# Altium project PCB_Project1.PrjPCB
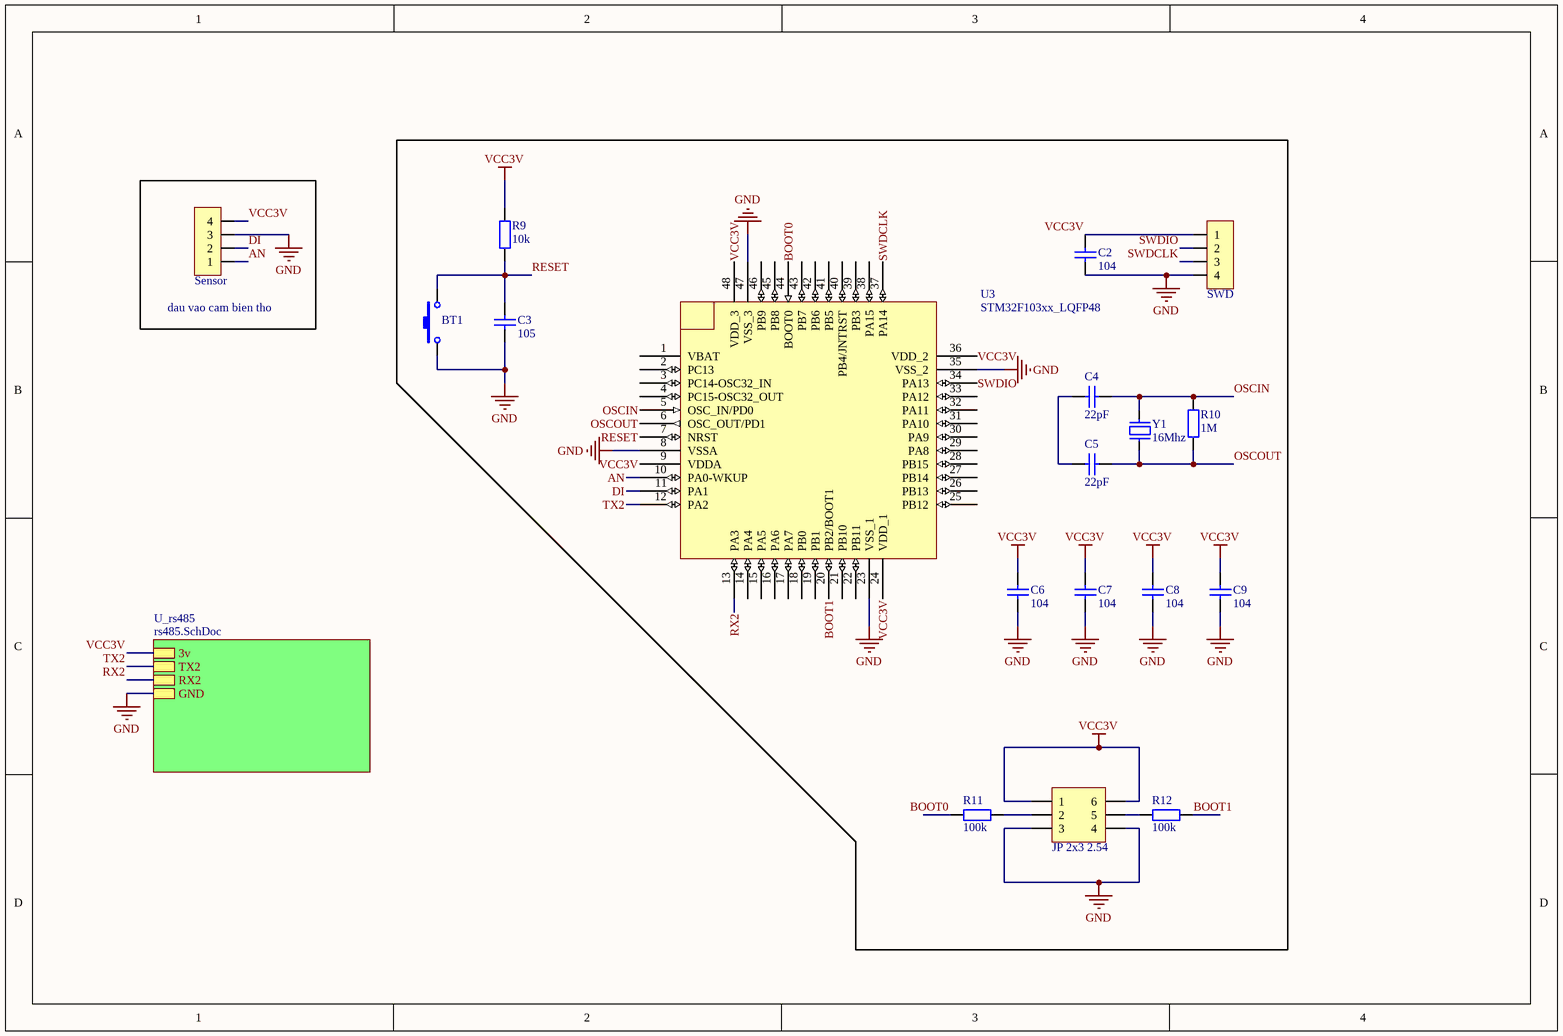
[diagram p0: Sheet1.SchDoc]
2 sheets, 38 parts. Net scope: hierarchical (ports join the sheet entries above them; power ports are global).
Board file: PCB1.PcbDoc
Sheets:
  Sheet1.SchDoc
    U_rs485 = rs485.SchDoc

## Sheet Sheet1.SchDoc
size A4

### Parts
BT1  Nut Nhan 2 Chan SMD 3x6x2.5  [Nut Nhan 2 Chan SMD 3x6x2.5]  (value not drawn)
C2  104  [tu 0603]
C3  105  [tu 0603]
C4  22pF  [tu 0603]
C5  22pF  [tu 0603]
C6  104  [tu 0603]
C7  104  [tu 0603]
C8  104  [tu 0603]
C9  104  [tu 0603]
JP1  Sensor  [JP 1x4 CC]
JP2  SWD  [JP 1x4 DT]
JP3  JP 2x3 2.54  [JP 2x3 DT]
R9  10k  [tro smd 0603]
R10  1M  [tro smd 0603]
R11  100k  [tro smd 0603]
R12  100k  [tro smd 0603]
U3  STM32F103xx_LQFP48  [STM32_LQPF48]
Y1  16Mhz  [Thach Anh 2 chan cam]

### Blocks framed on the sheet
dau vao cam bien tho: JP1

### Sub-sheets
U_rs485 = rs485.SchDoc: 3v, TX2, RX2, GND

### Nets
GND: BT1.1 C2.2 C3.2 C6.2 C7.2 C8.2 C9.2 JP1.3 JP2.4 JP3.3 JP3.4 U3.8(VSSA) U3.23(VSS_1) U3.35(VSS_2) U3.47(VSS_3) ; sheet U_rs485/GND
VCC3V: C2.1 C6.1 C7.1 C8.1 C9.1 JP1.4 JP2.1 JP3.1 JP3.6 R9.2 U3.9(VDDA) U3.24(VDD_1) U3.36(VDD_2) U3.48(VDD_3) ; sheet U_rs485/3v
AN: JP1.1 U3.10(PA0-WKUP)
BOOT0: R11.1 U3.44(BOOT0)
BOOT1: R12.2 U3.20(PB2/BOOT1)
DI: JP1.2 U3.11(PA1)
OSCIN: C4.1 R10.2 U3.5(OSC_IN/PD0) Y1.2
OSCOUT: C5.1 R10.1 U3.6(OSC_OUT/PD1) Y1.1
RESET: BT1.2 C3.1 R9.1 U3.7(NRST)
RX2: U3.13(PA3) ; sheet U_rs485/RX2
SWDCLK: JP2.3 U3.37(PA14)
SWDIO: JP2.2 U3.34(PA13)
TX2: U3.12(PA2) ; sheet U_rs485/TX2
NetC4_2: C4.2 C5.2
NetJP3_2: JP3.2 R11.2
NetJP3_5: JP3.5 R12.1

Not connected (* = marked no-connect by the designer): U3 1(VBAT) 2(PC13) 3(PC14-OSC32_IN) 4(PC15-OSC32_OUT) 14(PA4) 15(PA5) 16(PA6) 17(PA7) 18(PB0) 19(PB1) 21(PB10) 22(PB11) 25(PB12) 26(PB13) 27(PB14) 28(PB15) 29(PA8) 30(PA9) 31(PA10) 32(PA11) 33(PA12) 38(PA15) 39(PB3) 40(PB4/JNTRST) 41(PB5) 42(PB6) 43(PB7) 45(PB8) 46(PB9)

### Library data of the parts
BT1 = Nut Nhan 2 Chan SMD 3x6x2.5: Ma_Hang: MH001036; Ten: Nút Nhấn 2 Chân 3x6x2.5MM SMD
C2 C6-C9 = Tu 0603 104 50V 10%: Dán; Don_Vi: Con; So_Chan: 2; Ten_Linh_Kien: Tụ 0603 104-100nF 10% 50V; Ma_Hang: MH004568; Chung_Loai: Dán; Kieu_Chan: *
C3 = Tu 0603 105 16V 20%: Dán; Don_Vi: Con; So_Chan: 2; Ten_Linh_Kien: Tụ 0603 105-1uF 20% 16V; Ma_Hang: MH004574; Chung_Loai: Dán; Kieu_Chan: *
C4 C5 = Tu 0603 22pF 50V 10%: Dán; Don_Vi: Con; So_Chan: 2; Ten_Linh_Kien: Tụ 0603 22pF 50V 10%; Ma_Hang: MH004570; Chung_Loai: Dán; Kieu_Chan: *
JP1 = JP 1x4 2.54 Cai Cong: Cắm; Ten_Linh_Kien: Jump Đơn Cái 2.54MM 1x40P Cong; Don_Vi: Con; Ma_Hang: MH001265; Ghi_Chu: *; Kieu_Chan: *; Chung_Loai: Cắm
JP2 = JP 1x4 2.54 Duc Thang: Cắm; Ten_Linh_Kien: Jump Đơn Đực 2.54MM 1x40P Thẳng 11MM; Don_Vi: Con; Ma_Hang: MH000903; Ghi_Chu: *; Kieu_Chan: *; Chung_Loai: Cắm
JP3 = JP 2x3 2.54 Duc Thang: Cắm; Ten_Linh_Kien: Jump Đôi Đực 2.54MM 2x40P Thẳng 11MM; Don_Vi: Con; Ma_Hang: MH002686; Ghi_Chu: *; Kieu_Chan: *; Chung_Loai: Cắm
R9 = Tro 0603 5% 10k: Dán; Don_Vi: Con; So_Chan: 2; Ten_Linh_Kien: Trở 0603 5% 10k; Ma_Hang: MH006316; Chung_Loai: Dán; Kieu_Chan: *
R10 = Tro 0603 5% 1M: Dán; Don_Vi: Con; So_Chan: 2; Ten_Linh_Kien: Trở 0603 5% 1M; Ma_Hang: MH006909; Chung_Loai: Dán; Kieu_Chan: *
R11 R12 = Tro 0603 5% 100k: Dán; So_Chan: 2; Ten_Linh_Kien: Trở 0603 5% 100k; Ma_Hang: MH006314; Don_Vi: Con; Chung_Loai: Dán; Kieu_Chan: *
Y1 = Thach Anh 2 chan Cam: Crystal For all Crystal 2pin.; Value: 4Mhz
U3 = STM32F103xx_LQFP48: Published: 30-May-2008; DatasheetVersion: rev6, Mar-2008; PackageVersion: Mar-2008; PackageReference: LQFP48; Publisher: Altium Limited; PackageDescription: 48-Pin Low-Profile Quad Flat Pack, 7 x 7 mm Body, 0.5 mm Pitch (LQFP48); ComponentLink1Description: Manufacturer Link; ComponentLink1URL: www.st.com/stm32; ComponentLink2Description: Datasheet; ComponentLink2URL: http://www.st.com/stonline/products/literature/ds/13587.pdf

## Sheet rs485.SchDoc
size A
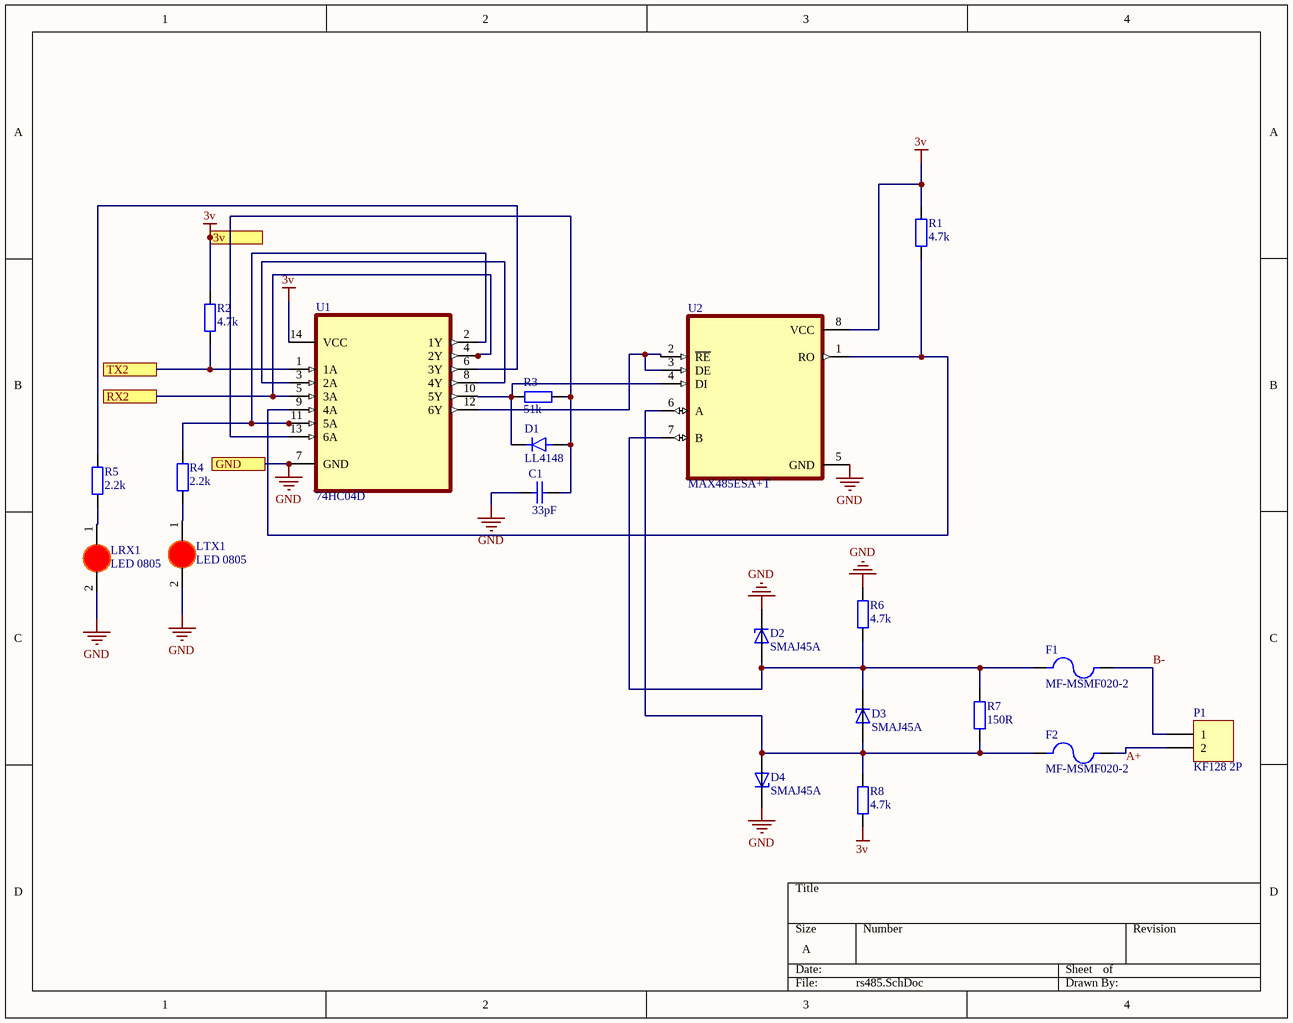
[diagram p1: rs485.SchDoc]

### Parts
C1  33pF  [tu 0805]
D1  LL4148  [DIO_LL4148]
D2  SMAJ45A  [DIOM4325X250N]
D3  SMAJ45A  [DIOM4325X250N]
D4  SMAJ45A  [DIOM4325X250N]
F1  MF-MSMF020-2  [FUSER_MF-MSMF020-2]
F2  MF-MSMF020-2  [FUSER_MF-MSMF020-2]
LRX1  LED 0805  [LED-0805-Red]
LTX1  LED 0805  [LED-0805-Red]
P1  KF128 2P  [KF128_2P]
R1  4.7k  [tro smd 0603]
R2  4.7k  [tro smd 0603]
R3  51k  [tro smd 0603]
R4  2.2k  [tro smd 0603]
R5  2.2k  [tro smd 0603]
R6  4.7k  [tro smd 0603]
R7  150R  [tro smd 0603]
R8  4.7k  [tro smd 0603]
U1  74HC04D  [SOIC127P600X175-14N]
U2  MAX485ESA+T  [SOIC127P600X175-8N]

### Ports
3v, GND, RX2, TX2

### Nets
3v: R1.2 R2.2 R8.1 U1.14(VCC) U2.8(VCC) ; port 3v  [project net VCC3V]
GND: C1.2 D2.C D4.C LRX1.2(K) LTX1.2(K) R6.2 U1.7(GND) U2.5(GND) ; port GND
A+: F2.2 P1.2
B-: F1.2 P1.1
RX2: U1.4(2Y) U1.5(3A) ; port RX2
TX2: R2.1 U1.1(1A) ; port TX2
NetC1_1: C1.1 D1.A R3.2 U1.13(6A)
NetD1_C: D1.C R3.1 U1.10(5Y) U2.4(DI)
NetD2_A: D2.A D3.C F1.1 R6.1 R7.2 U2.7(B)
NetD3_A: D3.A D4.A F2.1 R7.1 R8.2 U2.6(A)
NetLRX1_1: LRX1.1(A) R5.1
NetLTX1_1: LTX1.1(A) R4.1
NetR1_1: R1.1 U1.9(4A) U2.1(RO)
NetR4_2: R4.2 U1.2(1Y) U1.11(5A)
NetR5_2: R5.2 U1.6(3Y)
NetU1_3: U1.3(2A) U1.8(4Y)
NetU1_12: U1.12(6Y) U2.2(~{RE}) U2.3(DE)

### Library data of the parts
C1 = Tu 0805 33pF 50V 10%: Dán; Don_Vi: Con; So_Chan: 2; Ten_Linh_Kien: Tụ 0805 33p 10% 50V; Ma_Hang: MH004563; Chung_Loai: Dán; Kieu_Chan: *
D1 = LL4148: Diode Small Signal Switching 100V 0.15A Automotive 2-Pin Mini-MELF T/R; MF: Diotec Semiconductor; Value: *; SnapEDA_Link: https://www.snapeda.com/parts/LL4148/Diotec/view-part/?ref=snap; Purchase-URL: https://pricing.snapeda.com/search/part/LL4148/?ref=eda; Availability: In Stock; Price: None; Package: MINIMELF-2 Diotec; Check_prices: https://www.snapeda.com/parts/LL4148/Diotec/view-part/?ref=eda; MP: LL4148
D2-D4 = SMAJ45A: 72.7V Clamp 5.5A Ipp Tvs Diode Surface Mount DO-214AC (SMA); MF: Littelfuse; Value: *; Check_prices: https://www.snapeda.com/parts/SMAJ45A/Littelfuse/view-part/?ref=eda; Package: DO-214; Availability: Unavailable; SnapEDA_Link: https://www.snapeda.com/parts/SMAJ45A/Littelfuse/view-part/?ref=snap; MP: SMAJ45A; Price: None
F1 F2 = MF-MSMF020-2: Polymeric PTC Resettable Fuse 30V 200 mA Ih Surface Mount 1812 (4532 Metric), Concave; MF: Bourns; Package: 1812 Bourns; Price: None; MP: MF-MSMF020-2; Availability: In Stock; Value: *; Check_prices: https://www.snapeda.com/parts/MF-MSMF020-2/Bourns/view-part/?ref=eda; Purchase-URL: https://pricing.snapeda.com/search/part/MF-MSMF020-2/?ref=eda; SnapEDA_Link: https://www.snapeda.com/parts/MF-MSMF020-2/Bourns/view-part/?ref=snap
LRX1 LTX1 = LED 0805 Do: Dán; Don_Vi: Con; Ma_Hang: MH000897; Ten_Linh_Kien: LED 0805 Màu Đỏ (Red); Ghi_Chu: *; Kieu_Chan: *; Chung_Loai: Dán
P1 = KF128 2P: Header, 2-Pin, pitch 5.08mm; MPN: KF128-2P; Solder: WAVE
R1 R2 R6 R8 = Tro 0603 5% 4.7k: Dán; Don_Vi: Con; So_Chan: 2; Ten_Linh_Kien: Trở 0603 5% 4.7k; Ma_Hang: MH006327; Chung_Loai: Dán; Kieu_Chan: *
R3 = Tro 0603 5% 51k: Dán; Don_Vi: Con; So_Chan: 2; Ten_Linh_Kien: Trở 0603 5% 51k; Ma_Hang: MH007666; Chung_Loai: Dán; Kieu_Chan: *
R4 R5 = Tro 0603 5% 2.2k: Dán; Don_Vi: Con; So_Chan: 2; Ten_Linh_Kien: Trở 0603 5% 2.2k; Ma_Hang: MH006321; Chung_Loai: Dán; Kieu_Chan: *
R7 = Tro 0603 5% 150R: Dán; Don_Vi: Con; So_Chan: 2; Ten_Linh_Kien: Trở 0603 5% 150R; Ma_Hang: MH006318; Chung_Loai: Dán; Kieu_Chan: *
U1 = 74HC04D: Inverter IC 6 Channel 14-SOIC; MF: Toshiba; Value: *; MP: 74HC04D; Package: SOIC-14 NXP Semiconductors; Price: None; Availability: Unavailable; SnapEDA_Link: https://www.snapeda.com/parts/74HC04D/Toshiba%20Semiconductor%20and%20Storage/view-part/1040011/?ref=snap
U2 = MAX485ESA+T: 1/1 Transceiver Half RS422, RS485 8-SOIC; MF: Maxim Integrated; MP: MAX485ESA; SnapEDA_Link: https://www.snapeda.com/parts/MAX485ESA/Maxim+Integrated/view-part/?ref=snap; Purchase-URL: https://pricing.snapeda.com/search/part/MAX485ESA/?ref=eda; Value: *; Package: SOIC-8 Maxim; Price: None; Availability: In Stock; Check_prices: https://www.snapeda.com/parts/MAX485ESA/Maxim+Integrated/view-part/?ref=eda

## Nets that join several sheets
GND: Sheet1 (15 pins), rs485 (8 pins)
VCC3V: Sheet1 (14 pins), rs485 (5 pins)
RX2: Sheet1 (U3.13), rs485 (U1.4 U1.5)
TX2: Sheet1 (U3.12), rs485 (R2.1 U1.1)